# EAGLE design spiEeprom (EAGLE 6.3)
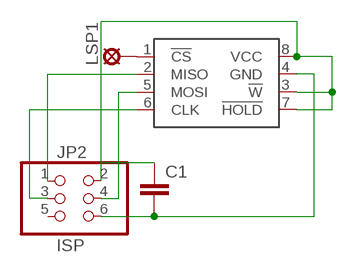
[diagram p0: schematic, sheet 1]

## Parts
C1  C-EUC0603  [C0603]
JP2  ISP  PINHD-2X3  [2X03]
LSP1  LSP10  [LSP10]
U$1  M95XXSO  [SO08]

## Nets
CLK: JP2.3 U$1.6(CLK)
GND: C1.2 JP2.6 U$1.4(GND)
MISO: JP2.1 U$1.2(MISO)
MOSI: JP2.4 U$1.5(MOSI)
N$7: LSP1.MP U$1.1(!CS)
VCC: C1.1 JP2.2 U$1.3(!W) U$1.7(!HOLD) U$1.8(VCC)
Unconnected: JP2.5

## Library data of the parts
C1 = .rcl:C-EU: CAPACITOR, European symbol
JP2 = pinhead:PINHD-2X3: PIN HEADER
LSP1 = solpad:LSP10: SOLDER PAD drill 1.0 mm, distributor Buerklin, 12H555
U$1 = st-microelectronics:M95XX

## Board
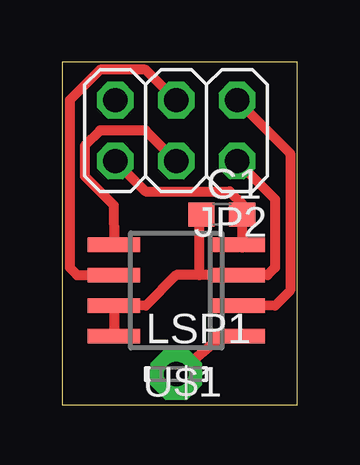
[diagram p1: board, top side]

Size 9.82 x 14.28 mm. Coordinates in mm from the lower left corner, seen from the top.
Outline: 0,0 9.82,0 9.82,14.28 0,14.28 0,0
Copper layers (1*16): Top 0.035mm / dielectric 1.5mm / Bottom 0.035mm
Design rules "default": minimum track width 10mil, minimum drill 24mil, track to track 8mil, track to pad 8mil, pad to pad 8mil, via to via 8mil, smd to smd 8mil, copper to edge 40mil, drill to drill 8mil, minimum pad ring 10mil, minimum via ring 8mil, stop-mask expansion 4mil, vias tented up to drill 0mil, thermal gap 10mil

### Footprints (pad centres in the part's own frame; a part is rotated, then mirrored left to right if it is on the bottom)
C0603 = smd 1.1 x 1: 1 -0.85,0; 2 0.85,0
2X03 = drill 1.016 octagon: 1 -2.54,-1.27; 2 -2.54,1.27; 3 0,-1.27; 4 0,1.27; 5 2.54,-1.27; 6 2.54,1.27
LSP10 = drill 1.016 pad 2.159 octagon: MP 0,0
SO08 = smd 0.6 x 2.2: 1 -1.905,-2.6; 2 -0.635,-2.6; 3 0.635,-2.6; 4 1.905,-2.6; 5 1.905,2.6; 6 0.635,2.6; 7 -0.635,2.6; 8 -1.905,2.6

### Placement (x,y rotation side)
C1  6.67,7.94 0 top
JP2  4.76,11.43 180 top
LSP1  4.76,1.27 0 top
U$1  4.76,4.76 90 top

### Tracks (layer width: path | path; a pad name or v marks a point on that pad's centre or on a via)
CLK
  Top 0.406: JP2.3 3.49,13.97 1.59,13.97 0.32,12.7 0.32,5.72 0.63,5.4 U$1.6
GND
  Top 0.406: U$1.4 7.52,6.54 C1.2 7.52,8.36 6.99,8.89 3.49,8.89 JP2.6
MISO
  Top 0.406: JP2.1 9.53,10.48 9.53,4.76 8.88,4.12 U$1.2
MOSI
  Top 0.406: JP2.4 3.49,11.43 1.59,11.43 0.95,10.79 0.95,9.53 2.15,8.32 U$1.5
N$7
  Top 0.406: LSP1.MP 6.64,2.84 U$1.1
VCC
  Top 0.406: U$1.3 7.68,5.4 | U$1.3 5.71,5.4 | 5.71,5.4 4.76,5.4 3.48,4.12 U$1.7 U$1.8 | C1.1 5.71,7.83 5.71,5.4 | JP2.2 8.89,8.57 8.89,5.72 8.57,5.4 8.25,5.4 U$1.3